# EAGLE design mippe_32u4 (EAGLE 9.5.2)

## Sheet 1 of 2
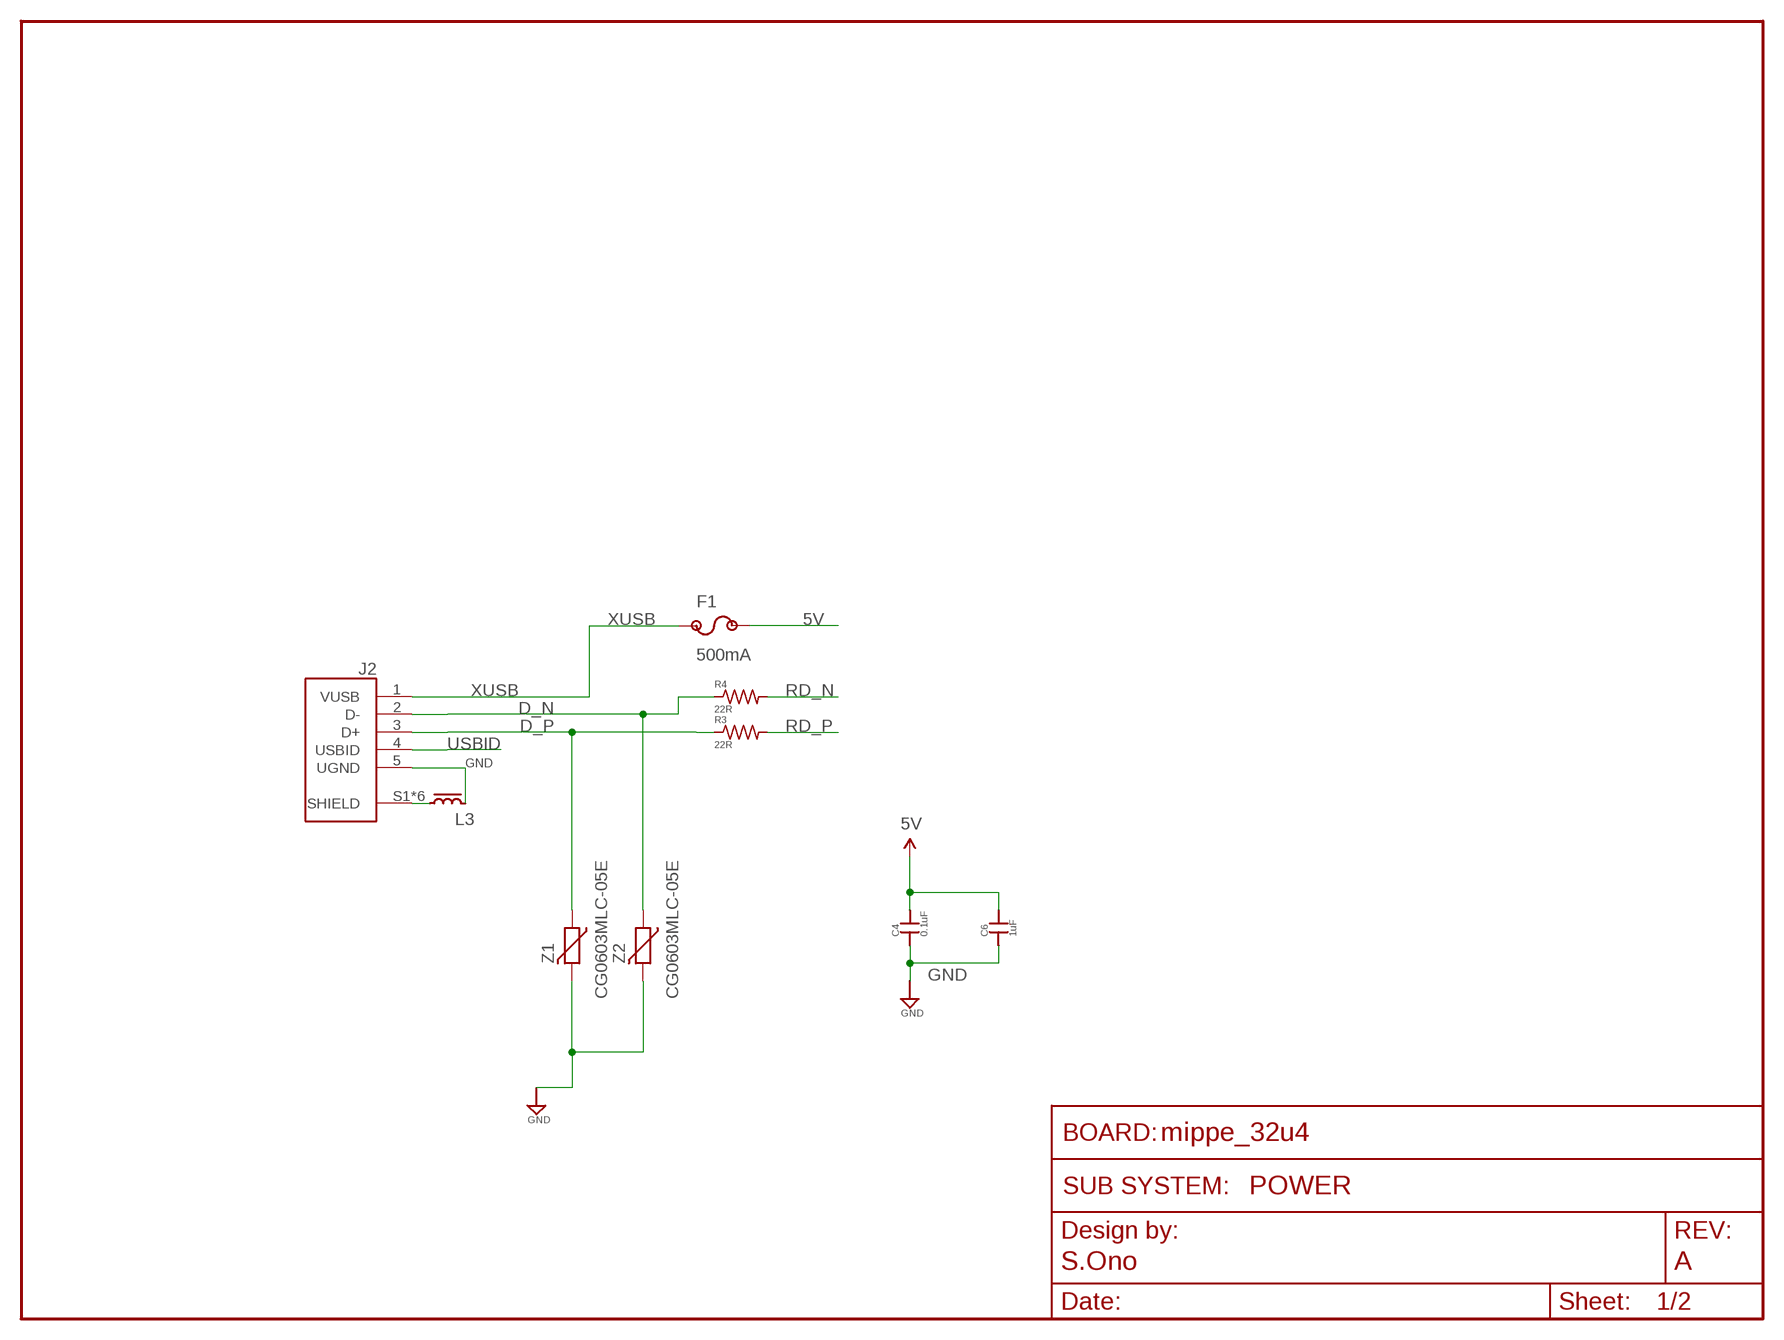
[diagram p0: schematic, sheet 1]
FRAME2 (FRAME_SCHEMATIC): AUTHOR: S.Ono; REV: A; SUBSYSTEM_NAME: POWER

### Parts
C4  0.1uF  CAP0402-CAP  [0402-CAP]
C6  1uF  CAP0402-CAP  [0402-CAP]
F1  500mA  0ZCJ0050FF2G1206  [1206]
J2  USB  [FCI_10103594-0001LF]
L3  IND  [IND_2012]
R3  22R  R-US_R0402  [R0402]
R4  22R  R-US_R0402  [R0402]
Z1  CG0603MLC-05E  VARISTOR  [0603-RES]
Z2  CG0603MLC-05E  VARISTOR  [0603-RES]

### Nets
5V: C4.2 C6.2 F1.2 ; also sheet 2
D_N: J2.2(D-) R4.1 Z2.1
D_P: J2.3(D+) R3.1 Z1.1
GND: C4.1 C6.1 J2.5(UGND) L3.2 Z1.2 Z2.2 ; also sheet 2
RD_N: R4.2 ; also sheet 2
RD_P: R3.2 ; also sheet 2
SHIELD: J2.S1(SHIELD) J2.S2(SHIELD) J2.S3(SHIELD) J2.S4(SHIELD) J2.S5(SHIELD) J2.S6(SHIELD) L3.1
USBID: J2.4(USBID)
XUSB: F1.1 J2.1(VUSB)

## Sheet 2 of 2
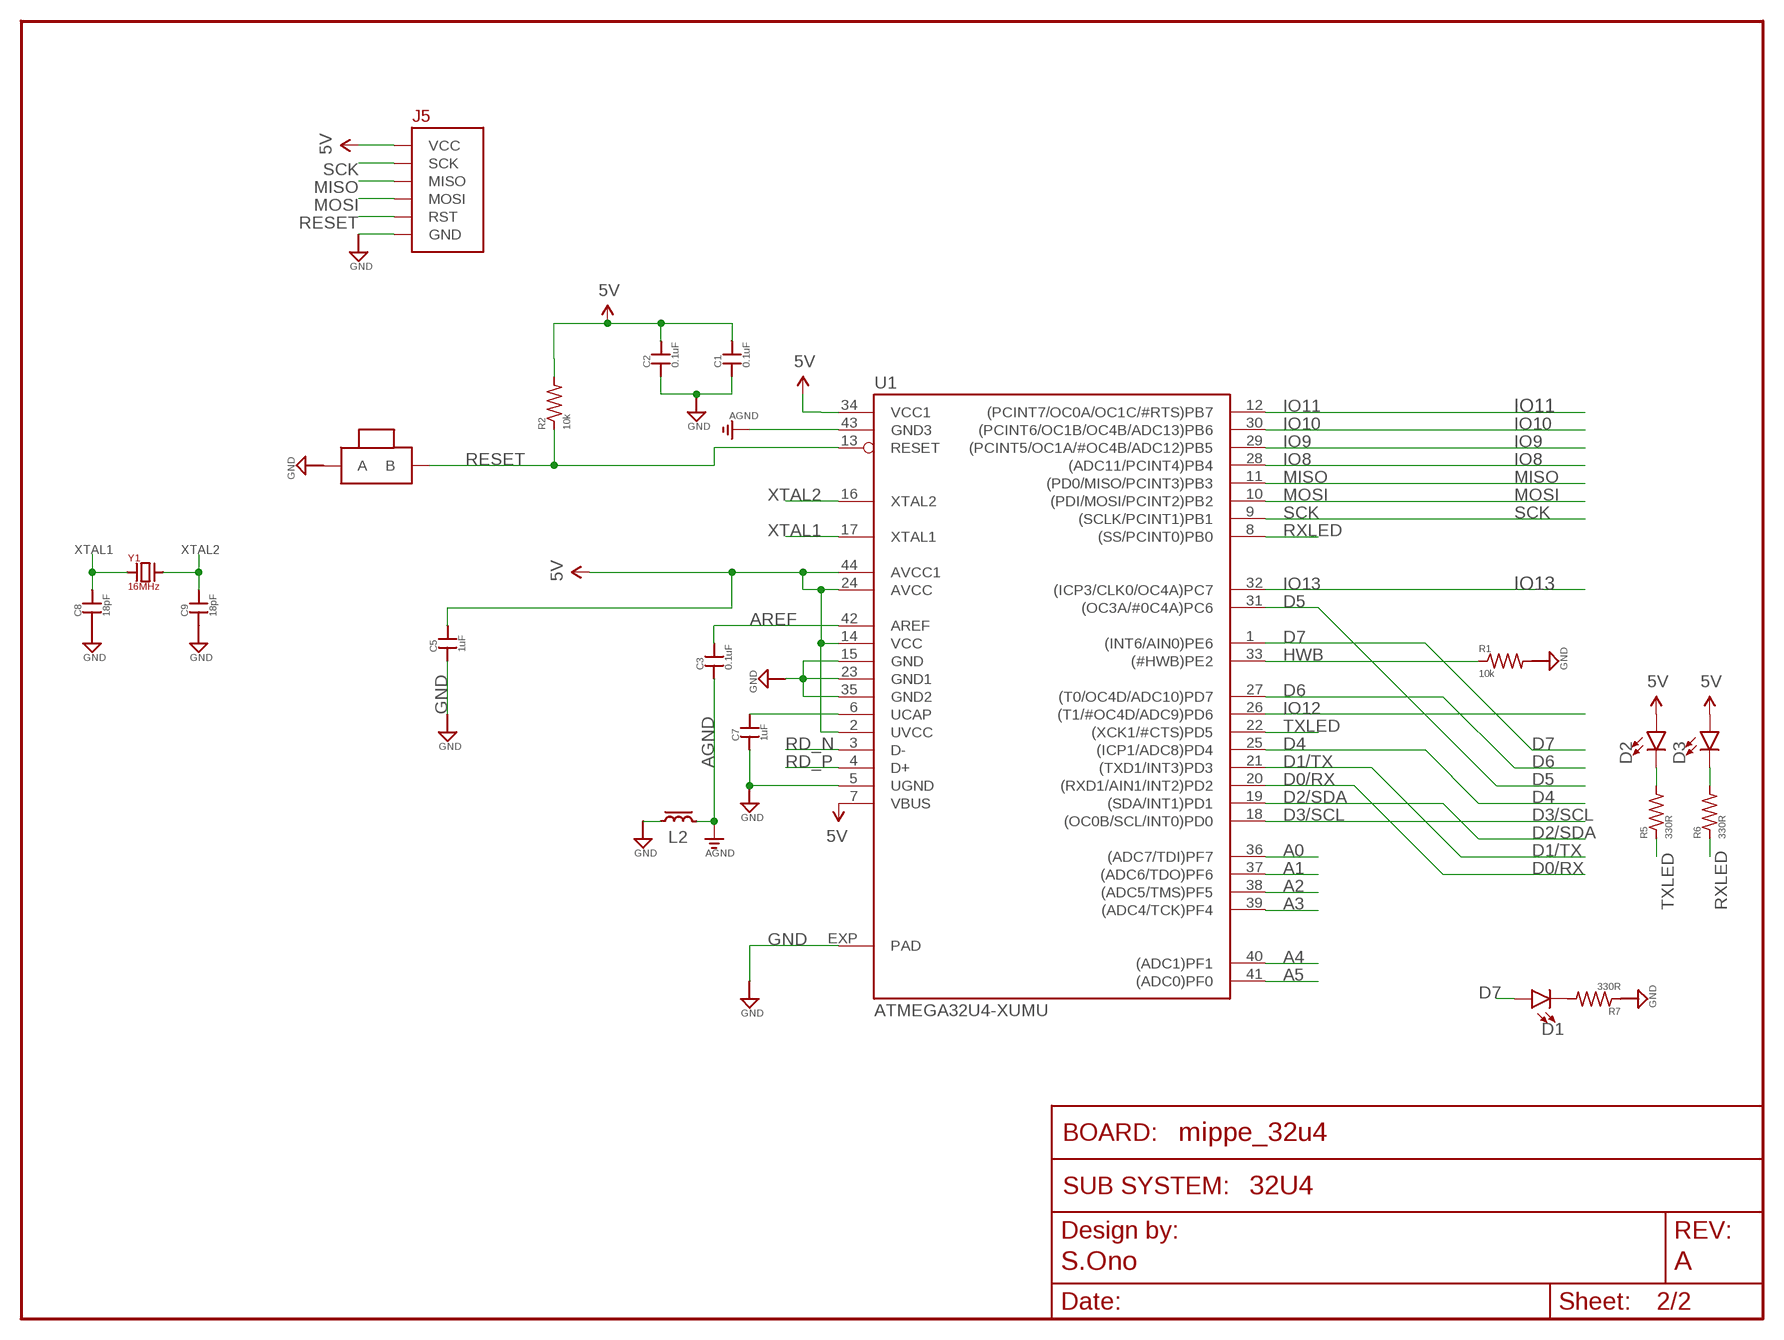
[diagram p1: schematic, sheet 2]
FRAME1 (FRAME_SCHEMATIC): AUTHOR: S.Ono; REV: A; SUBSYSTEM_NAME: 32U4

### Parts
C1  0.1uF  CAP0402-CAP  [0402-CAP]
C2  0.1uF  CAP0402-CAP  [0402-CAP]
C3  0.1uF  CAP0402-CAP  [0402-CAP]
C5  1uF  CAP0402-CAP  [0402-CAP]
C7  1uF  CAP0402-CAP  [0402-CAP]
C8  18pF  CAP0402-CAP  [0402-CAP]
C9  18pF  CAP0402-CAP  [0402-CAP]
D1  LED0603  [LED-0603]
D2  LED0603  [LED-0603]
D3  LED0603  [LED-0603]
J5  BURNIN  [BURNIN]
L2  IND  [IND_2012]
R1  10k  R-US_R0402  [R0402]
R2  10k  R-US_R0402  [R0402]
R5  330R  R-US_R0402  [R0402]
R6  330R  R-US_R0402  [R0402]
R7  330R  R-US_R0402  [R0402]
SW1  BTN-PTS810  [BTN_PTS810]
U1  ATMEGA32U4-XUMU  [QFN44ML7X7]
Y1  16MHz  CRYSTAL_SMOL  [XTAL500X320X130N]

### Nets
5V: C1.2 C2.2 C5.2 D2.A D3.A J5.3.3V(VCC) R2.2 U1.2(UVCC) U1.7(VBUS) U1.14(VCC) U1.24(AVCC) U1.34(VCC1) U1.44(AVCC1) ; also sheet 1
A0: U1.36((ADC7/TDI)PF7)
A1: U1.37((ADC6/TDO)PF6)
A2: U1.38((ADC5/TMS)PF5)
A3: U1.39((ADC4/TCK)PF4)
A4: U1.40((ADC1)PF1)
A5: U1.41((ADC0)PF0)
AGND: C3.1 L2.2 U1.43(GND3)
AREF: C3.2 U1.42(AREF)
D0/RX: U1.20((RXD1/AIN1/INT2)PD2)
D1/TX: U1.21((TXD1/INT3)PD3)
D2/SDA: U1.19((SDA/INT1)PD1)
D3/SCL: U1.18((OC0B/SCL/INT0)PD0)
D4: U1.25((ICP1/ADC8)PD4)
D5: U1.31((OC3A/#0C4A)PC6)
D6: U1.27((T0/OC4D/ADC10)PD7)
D7: D1.A U1.1((INT6/AIN0)PE6)
GND: C1.1 C2.1 C5.1 C7.1 C8.1 C9.1 J5.GND L2.1 R1.2 R7.1 SW1.1(A) SW1.2(A) U1.5(UGND) U1.15(GND) U1.23(GND1) U1.35(GND2) U1.EXP(PAD) ; also sheet 1
HWB: R1.1 U1.33((#HWB)PE2)
IO8: U1.28((ADC11/PCINT4)PB4)
IO9: U1.29((PCINT5/OC1A/#OC4B/ADC12)PB5)
IO10: U1.30((PCINT6/OC1B/OC4B/ADC13)PB6)
IO11: U1.12((PCINT7/OC0A/OC1C/#RTS)PB7)
IO12: U1.26((T1/#OC4D/ADC9)PD6)
IO13: U1.32((ICP3/CLK0/OC4A)PC7)
MISO: J5.MISO U1.11((PD0/MISO/PCINT3)PB3)
MOSI: J5.MOSI U1.10((PDI/MOSI/PCINT2)PB2)
N$1: D2.C R5.2
N$2: D3.C R6.2
N$4: D1.C R7.2
RD_N: U1.3(D-) ; also sheet 1
RD_P: U1.4(D+) ; also sheet 1
RESET: J5.RST R2.1 SW1.3(B) SW1.4(B) U1.13(RESET)
RXLED: R6.1 U1.8((SS/PCINT0)PB0)
SCK: J5.SCK U1.9((SCLK/PCINT1)PB1)
TXLED: R5.1 U1.22((XCK1/#CTS)PD5)
UCAP: C7.2 U1.6(UCAP)
XTAL1: C8.2 U1.17(XTAL1) Y1.1(A)
XTAL2: C9.2 U1.16(XTAL2) Y1.2(B)

## Library data of the parts
C1-C9 = scono:CAP: Capacitor Standard 0603 ceramic capacitor, and 0.1" leaded capacitor.; PIE-INT-REF-NUM: CAPACITOR-GENERIC
D1-D3 = scono:LED: https://www.digikey.com/products/en/optoelectronics/led-indication-discrete/105?k=&pkeyword=&pv7=2&pv1989=0&pv16=5&FV=ffe00069&quantity=0&ColumnSort=0&page=1&pageSize=25
F1 = scono:0ZCJ0050FF2G: https://www.digikey.com/product-detail/en/bel-fuse-inc/0ZCJ0050FF2G/507-1802-1-ND/4156236
J2 = scono:USB: Micro Usb, 2.0 Type b, Receptacle, Smt; DESCRIPTION: Micro Usb, 2.0 Type b, Receptacle, Smt; DIGI-KEY_PART_NUMBER: 609-4050-1-ND; DIGI-KEY_PURCHASE_URL: https://www.digikey.com/product-detail/en/amphenol-icc-fci/10103594-0001LF/609-4050-1-ND/2350357?utm_source=snapeda&utm_medium=aggregator&utm_campaign=symbol; MF: Amphenol ICC; MP: 10103594-0001LF; PACKAGE: None
J5 = scono:BURNIN
L2 L3 = scono:IND; MANUFACTURER_PART_NUMBER: MLZ2012M1R0HT000; VENDOR: TDK
R1-R7 = scono:R-US_: RESISTOR, American symbol
SW1 = scono:BTN-PTS810: https://www.digikey.com/product-detail/en/c-k/PTS810-SJM-250-SMTR-LFS/CKN10502CT-ND/4176673
U1 = scono:ATMEGA32U4-XU
Y1 = scono:CRYSTAL
Z1 Z2 = scono:VARISTOR: VARISTOR

## Net classes
0 default: width 0.089 mm, drill 0.2 mm, clearance 0.14 mm
2 gnd: width 0.089 mm, drill 0.2 mm, clearance 0.152 mm to class 1, clearance 0.14 mm

## Board
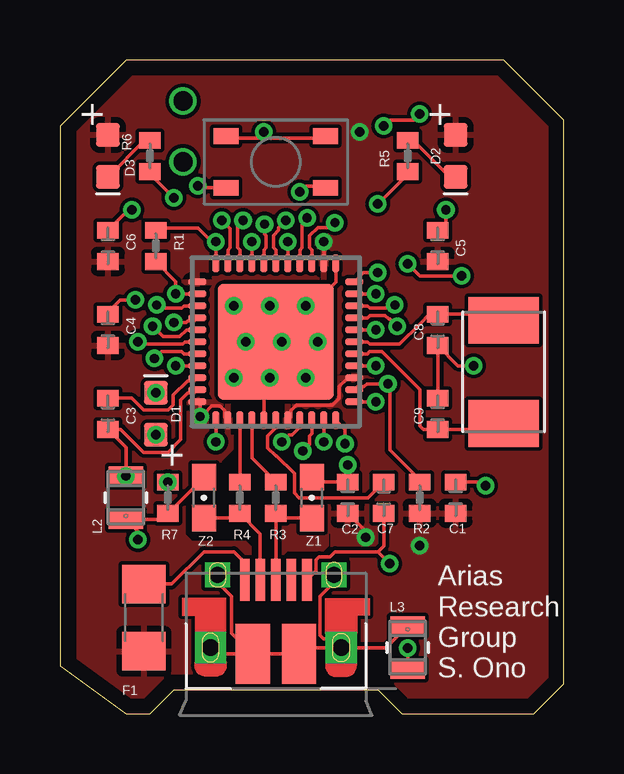
[diagram p2: board, top side]
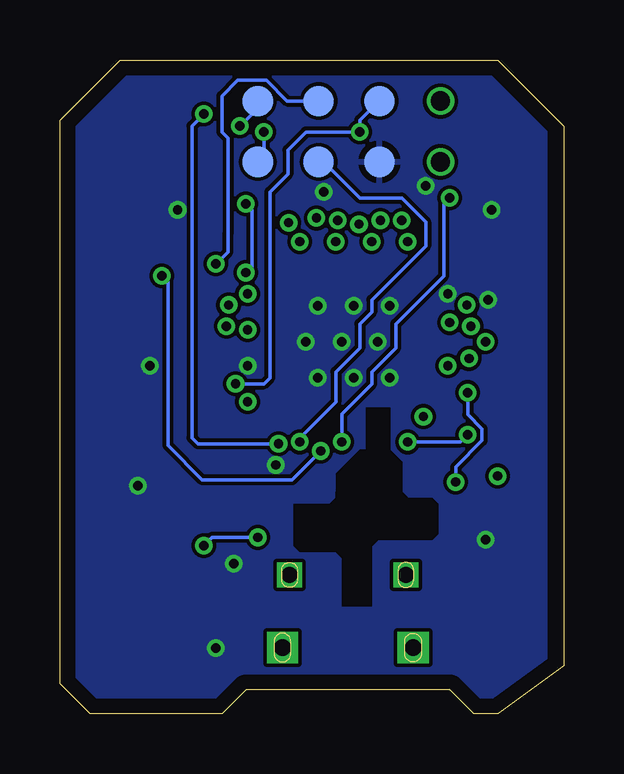
[diagram p3: board, bottom side, seen from below]

Size 21 x 27.25 mm. Coordinates in mm from the lower left corner, seen from the top.
Outline: 4.75,1 13.25,1 14.25,0 19.75,0 21,1.25 21,24.75 18.5,27.25 2.75,27.25 0,24.5 0,21.5 0,2 2.75,0 3.75,0 4.75,1
Copper layers (1*16): Top 2mil / dielectric 9mil / Bottom 2mil
Design rules "scono": minimum track width 6mil, minimum drill 15mil, track to track 6mil, track to pad 6mil, pad to pad 6mil, via to via 6mil, smd to smd 6mil, copper to edge 25mil, drill to drill 7mil, minimum pad ring 7mil, minimum via ring 7mil, stop-mask expansion 3mil, vias tented up to drill 0mil, thermal gap 10mil
tKeepout: 1 lines
tRestrict: 26 lines
bRestrict: 28 lines

### Footprints (pad centres in the part's own frame; a part is rotated, then mirrored left to right if it is on the bottom)
0402-CAP = smd 0.7 x 0.9: 1 -0.65,0; 2 0.65,0
LED-0603 = smd 1 x 1: A 0.877,0; C -0.877,0
1206 = smd 1.6 x 1.8: 1 -1.4,0; 2 1.4,0
FCI_10103594-0001LF = smd 0.4 x 1.75: 1 -1.3,2.825; 2 -0.65,2.825; 3 0,2.825; 4 0.65,2.825; 5 1.3,2.825 | smd 1.425 x 2.5: S1 -0.963,-0.25; S2 0.963,-0.25 | drill 0.65 pad 1.05 square: S3 -2.425,3.03; S4 2.425,3.03 | drill 0.7 pad 1.3 square: S5 -2.725,0; S6 2.725,0
BURNIN = smd 1.27 x 1.27 bottom: 3.3V 0,0; GND -5.08,0; MISO 0,2.54; MOSI -2.54,0; RST -5.08,2.54; SCK -2.54,2.54 | drill 0.8: P$7 -7.62,2.54; P$8 -7.62,0
IND_2012 = smd 0.803 x 1.45: 1 -0.902,0; 2 0.902,0
R0402 = smd 0.7 x 0.9: 1 -0.65,0; 2 0.65,0
BTN_PTS810 = smd 1.05 x 0.65: 1 -2.075,1.075; 2 2.075,1.075; 3 -2.075,-1.075; 4 2.075,-1.075
QFN44ML7X7 = smd 0.75 x 0.275: 1 -3.275,2.5; 2 -3.275,2; 3 -3.275,1.5; 4 -3.275,1; 5 -3.275,0.5; 6 -3.275,0; 7 -3.275,-0.5; 8 -3.275,-1; 9 -3.275,-1.5; 10 -3.275,-2; 11 -3.275,-2.5; 23 3.275,-2.5; 24 3.275,-2; 25 3.275,-1.5; 26 3.275,-1; 27 3.275,-0.5; 28 3.275,0; 29 3.275,0.5; 30 3.275,1; 31 3.275,1.5; 32 3.275,2; 33 3.275,2.5 | smd 0.275 x 0.75: 12 -2.5,-3.275; 13 -2,-3.275; 14 -1.5,-3.275; 15 -1,-3.275; 16 -0.5,-3.275; 17 0,-3.275; 18 0.5,-3.275; 19 1,-3.275; 20 1.5,-3.275; 21 2,-3.275; 22 2.5,-3.275; 34 2.5,3.275; 35 2,3.275; 36 1.5,3.275; 37 1,3.275; 38 0.5,3.275; 39 0,3.275; 40 -0.5,3.275; 41 -1,3.275; 42 -1.5,3.275; 43 -2,3.275; 44 -2.5,3.275 | smd 4.826 x 4.826: EXP 0,0
XTAL500X320X130N = smd 1.95 x 2.95: 1 -2.15,0; 2 2.15,0
0603-RES = smd 1.1 x 1: 1 -0.85,0; 2 0.85,0

### Placement (x,y rotation side)
C1  16.5,9 270 top
C2  12,9 270 top
C3  2,12.5 90 top
C4  2,16 270 top
C5  15.75,19.5 270 top
C6  2,19.5 270 top
C7  13.5,9 90 top
C8  15.75,16 90 top
C9  15.75,12.5 270 top
D1  4,12.5 270 top
D2  16.5,23.25 90 top
D3  2,23.25 90 top
F1  3.5,4 270 top
J2  9,2.75 0 top
J5  12.75,23 0 top
L2  2.75,9 90 top
L3  14.5,2.75 270 top
R1  4,19.5 270 top
R2  15,9 270 top
R3  9,9 90 top
R4  7.5,9 90 top
R5  14.5,23.25 90 top
R6  3.75,23.25 90 top
R7  4.5,9 90 top
SW1  9,23 180 top
U1  9,15.5 90 top
Y1  18.5,14.25 270 top
Z1  10.5,9 90 top
Z2  6,9 90 top

### Tracks (layer width: path | path; a pad name or v marks a point on that pad's centre or on a via)
5V  (via drill 0.38)
  Top 0.152: U1.24 v11,19.67 | U1.44 5.84,12.88 5.84,12.5 | 5.84,12.5 v5.84,12.38 | U1.2 6.87,12.36 6.87,12.63 6.67,12.83 6.33,12.83 6,12.5 5.84,12.5 | U1.7 9.63,12.36 9.63,12.63 9.86,12.86 11.37,12.86 11.64,13.13 11.64,13.64 12,14 U1.14 | C2.2 12.75,7.6 v12.75,7.35
  Bottom 0.152: v12.75,7.35 14.65,7.35 v15,7 | J5.3.3V 12.5,23.25 v12.5,24.25
  pour Top: 0.75,0 21,0 21,27 0.75,27
A0  (via drill 0.38)
  Top 0.152: U1.36 5.17,17 5.08,16.9 4.17,16.9 v4.04,17.04
A1  (via drill 0.38)
  Top 0.152: U1.37 5.59,16.37 5.32,16.37 5.26,16.31 v4.75,16.31
A2  (via drill 0.38)
  Top 0.152: U1.38 5.29,16 5,15.71 4.3,15.71 v3.86,16.15
A3  (via drill 0.38)
  Top 0.152: U1.39 5.22,15.5 5.12,15.4 3.35,15.4 v3.25,15.5
A4  (via drill 0.38)
  Top 0.152: U1.40 5.17,15 5.08,15.1 4.23,15.1 v3.94,14.81
A5  (via drill 0.38)
  Top 0.152: U1.41 v4.83,14.5
AGND  (via drill 0.38)
  Top 0.152: L2.2 2.75,11.1 C3.1 2.54,11.85 3.49,10.89 4.51,10.89 5.03,11.42 5.03,13.08 5.32,13.37 5.59,13.37 U1.43
  other vias: 2.75,9.9
AREF
  Top 0.152: U1.42 5.59,13.87 5.32,13.87 4.73,13.28 4.73,12.87 4.51,12.65 3.49,12.65 2.99,13.15 C3.2
D0/RX  (via drill 0.38)
  Top 0.152: U1.20 12.83,17 12.92,16.9 13.83,16.9 v13.96,17.04
D1/TX  (via drill 0.38)
  Top 0.152: U1.21 v13.17,17.5
D2/SDA  (via drill 0.38)
  Top 0.152: U1.19 12.83,16.5 12.92,16.6 13.56,16.6 13.72,16.44 13.77,16.44 v14.06,16.15
D3/SCL  (via drill 0.38)
  Top 0.152: U1.18 v13.17,16
D4  (via drill 0.38)
  Top 0.152: U1.25 10.5,19.33 10.4,19.42 10.4,19.92 10.75,20.27 11.27,20.27 v11.46,20.46
D5  (via drill 0.38)
  Top 0.152: U1.31 7.5,19.33 7.4,19.42 7.4,20.32 v7.64,20.56
D6  (via drill 0.38)
  Top 0.152: U1.27 v9.5,19.67
D7  (via drill 0.38)
  Top 0.152: U1.1 v6.5,11.33
  Bottom 0.152: v6.5,11.33 4.29,11.33 D1.A
  other vias: 4,11.62
D_N
  Top 0.152: Z2.1 7.3,8.15 R4.1 8.35,7.5 J2.2
D_P
  Top 0.152: J2.3 R3.1 9.2,8.15 Z1.1
GND  (via drill 0.38)
  Top 0.152: U1.35 5.25,17.5 v4.83,17.5 4.83,18.02 R1.2 | U1.15 v13.17,14.5 | U1.23 11.5,18 U1.EXP | C9.1 C8.1 16.6,14.5 v17.25,14.5 | v3.25,7.25 3.25,7.6 L2.1 4.25,8.1 R7.1 Z2.2 | U1.5 8.5,15 U1.EXP | Z1.2 10.7,9.65 C2.1 v12,10.36 | 13.25,6.75 11.47,6.75 11.26,6.53 10.8,6.53 10.67,6.4 10.67,5.95 J2.5 | 13.25,6.75 13.5,7 C7.1 | C1.1 17.6,9.65 v17.75,9.5 | L3.2 v14.5,2.73 | C4.1 2,16.75 2.5,17.25 v3.15,17.25 | R1.2 4,18.75 R1.2 | v10,21.75 10.25,22 11,22 SW1.1 | U1.EXP v9.25,15.5 | C5.1 16.1,20.5 v16.1,21 | SW1.2 5.83,21.93 v5.75,22 | C6.1 2.85,21 v3,21 | 13.25,6.75 v13.75,6.25
  other vias: 7.25,17 8.75,17 10.25,17 10.75,15.5 7.75,15.5 7.25,14 8.75,14 10.25,14
  pour Bottom: 0.75,27 0.75,0 21,0 21,27
HWB  (via drill 0.38)
  Top 0.152: U1.33 v6.5,19.67 6.5,19.75 6.25,19.75 5.75,20.25 4,20.25 R1.1
IO8  (via drill 0.38)
  Top 0.152: U1.28 9,19.33 8.9,19.42 8.9,19.93 9.12,20.15 9.12,20.27 v9.42,20.56
IO9  (via drill 0.38)
  Top 0.152: U1.29 8.5,19.33 8.6,19.42 8.6,19.92 8.53,19.99 v8.53,20.4
IO10  (via drill 0.38)
  Top 0.152: U1.30 v8,19.67
IO11  (via drill 0.38)
  Top 0.152: U1.12 v13.17,13
IO12  (via drill 0.38)
  Top 0.152: U1.26 10,19.33 10.1,19.42 10.1,20.46 v10.31,20.66
IO13  (via drill 0.38)
  Top 0.152: U1.32 7,19.33 7.1,19.42 7.1,20.21 v6.75,20.56
MISO  (via drill 0.38)
  Top 0.152: U1.11 11.89,11.84 v11.89,11.25 | v15,25 14.75,24.75 13.75,24.75 v13.5,24.5
  Bottom 0.152: v15,25 15.5,24.5 15.5,11.5 15.25,11.25 v11.89,11.25 | v13.5,24.5 12.75,25.25 12.75,25.5 J5.MISO
MOSI  (via drill 0.38)
  Top 0.152: U1.10 v11,11.33
  Bottom 0.152: v11,11.33 11,11.5 9.5,13 9.5,14.25 8.5,15.25 8.5,16.25 8,16.75 8,17.25 5.75,19.5 5.75,20.5 6.75,21.5 8.5,21.5 10,23 J5.MOSI
N$1
  Top 0.152: D2.C 16.25,22.37 14.72,23.9 R5.2
N$2
  Top 0.152: D3.C 3.53,23.9 R6.2
N$4  (via drill 0.38)
  Bottom 0.152: D1.C 4,12.47 3.4,11.87 3.4,11.38 4.5,10.28 R7.2
  other vias: 4,13.38 4.5,9.65
RD_N
  Top 0.152: U1.3 R4.2
RD_P
  Top 0.152: R3.2 8,10.65 U1.4
RESET  (via drill 0.38)
  Top 0.152: U1.13 12.41,13.63 12.68,13.63 12.8,13.75 v13.68,13.75 13.77,13.66 13.77,10.98 15,9.75 R2.1 | 8.5,24 11,24 SW1.3 | 8.5,24 7,24 SW1.4 | 8.5,24 v8.5,24.25
  Bottom 0.152: v13.68,13.75 12.5,13.75 12.25,14 12.25,21.75 11.5,22.5 11.5,23.5 10.75,24.25 v8.5,24.25 8.5,24.75 7.71,25.54 J5.RST
RXLED  (via drill 0.38)
  Top 0.152: v9.25,11.33 9.54,11.62 9.67,11.62 10,11.95 U1.8 | v4.75,21.5 3.75,22.5 R6.1
  Bottom 0.152: v4.75,21.5 5,21.25 5,18.25 7,16.25 7,15.25 8,14.25 8,13.75 9.25,12.5 9.25,11.5 v9.25,11.33
SCK  (via drill 0.38)
  Top 0.152: U1.9 10.5,11.67 10.4,11.58 10.4,11.22 v10.12,10.95 | v16.75,18.25 15,18.25 v14.5,18.75
  Bottom 0.152: v10.12,10.95 11.32,9.75 15.06,9.75 16.5,11.19 16.5,18 v16.75,18.25 | v14.5,18.75 14,19.25 14,20 14,24 14.25,24.25 14.25,25.75 13.6,26.4 12.39,26.4 11.53,25.54 J5.SCK
SHIELD
  Top 0.152: L3.1 13.6,2.75 11.75,2.75 | 11.75,2.75 J2.S6 10.21,2.75 J2.S2 J2.S1 8,2.5 | 11.75,2.75 11.38,3.12 10.98,3.12 10.85,3.25 10.85,4.89 11.43,5.47 J2.S4 | 8,2.5 6.53,2.5 J2.S5 | 8,2.5 7.15,3.35 7.15,4.89 6.58,5.47 J2.S3
TXLED  (via drill 0.38)
  Top 0.152: U1.22 12.66,18.39 v13.25,18.39 | v13.25,21.25 14.5,22.5 R5.1
  Bottom 0.152: v13.25,21.25 13,21 13,18.5 13.25,18.25 v13.25,18.39
UCAP
  Top 0.152: U1.6 9,11.92 8.65,11.58 8.65,11.08 9,10.73 9.04,10.73 9.77,10 9.77,9.21 9.98,9 12.85,9 C7.2
XTAL1
  Top 0.152: U1.17 12.83,15.5 12.92,15.4 14.16,15.4 15,16.24 15,16.25 15.4,16.65 C8.2 18.25,16.65 Y1.1
XTAL2
  Top 0.152: U1.16 12.83,15 12.91,15.09 | 12.91,15.09 12.92,15.1 | 12.91,15.09 12.92,15.1 | 12.92,15.1 13.42,15.1 15,13.52 15,12 15.15,11.85 C9.2 18.25,11.85 Y1.2
XUSB
  Top 0.152: F1.1 4.65,5.4 6,6.75 7.25,6.75 7.7,6.3 J2.1

### Text on the board
tPlace: Arias / Research / Group / S. Ono
bCream: Design by Seiya Fa'19